# EAGLE design electrosteel2020_10_arrange6_newstringconnector (EAGLE 9.6.2)
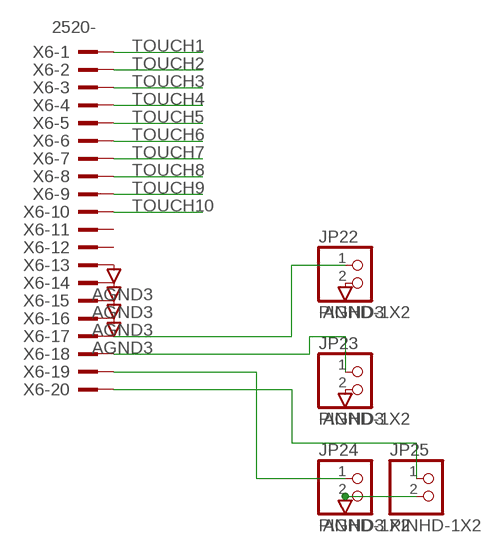
[diagram p0: schematic, sheet 1]

## Parts
JP22  PINHD-1X2  [1X02]
JP23  PINHD-1X2  [1X02]
JP24  PINHD-1X2  [1X02]
JP25  PINHD-1X2  [1X02]
X6  2520-  [PAK100/2500-20]

## Nets
AGND3: JP22.2 JP23.2 JP24.2 JP25.2 X6.13 X6.14 X6.15 X6.16
N$20: JP24.1 X6.19
N$22: JP25.1 X6.20
N$23: JP23.1 X6.18
N$24: JP22.1 X6.17
TOUCH1: X6.1
TOUCH2: X6.2
TOUCH3: X6.3
TOUCH4: X6.4
TOUCH5: X6.5
TOUCH6: X6.6
TOUCH7: X6.7
TOUCH8: X6.8
TOUCH9: X6.9
TOUCH10: X6.10
Unconnected: X6.11 X6.12

## Library data of the parts
JP22-JP25 = Connector:PINHD-1X2: PIN HEADER; CATEGORY: CONNECTOR; PARTNO: *DNP; SUB-CATEGORY: PIN-HEADER
X6 = con-3m:2520-: 3M (TM) Pak 100 4-Wall Header Source: 3M; OC_FARNELL: unknown; OC_NEWARK: unknown; PARTNO: N2520-6003-UG

## Board
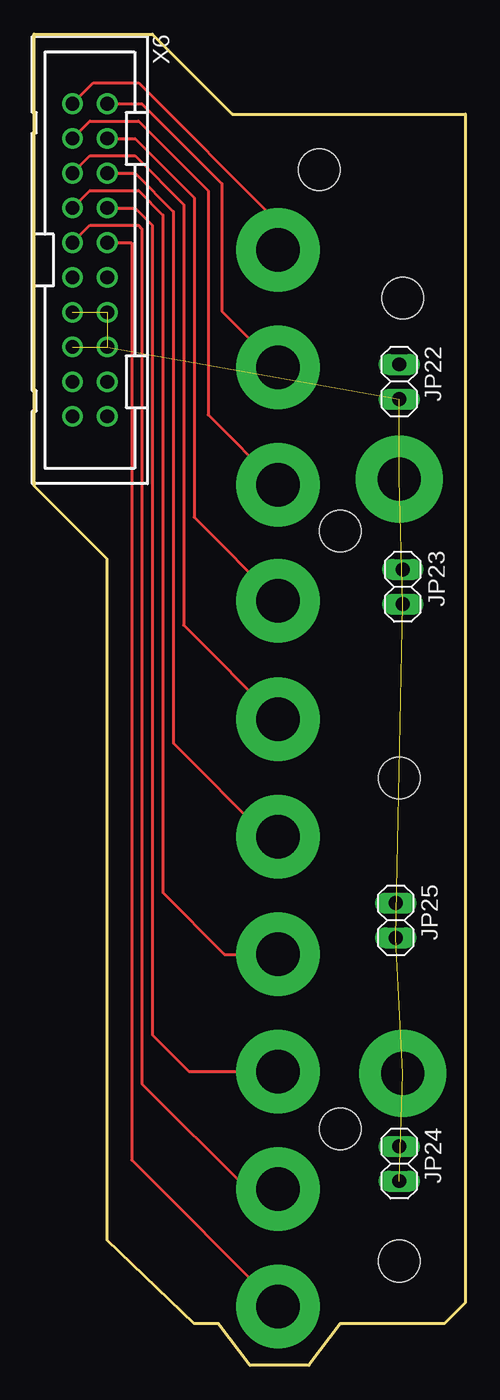
[diagram p1: board, top side]
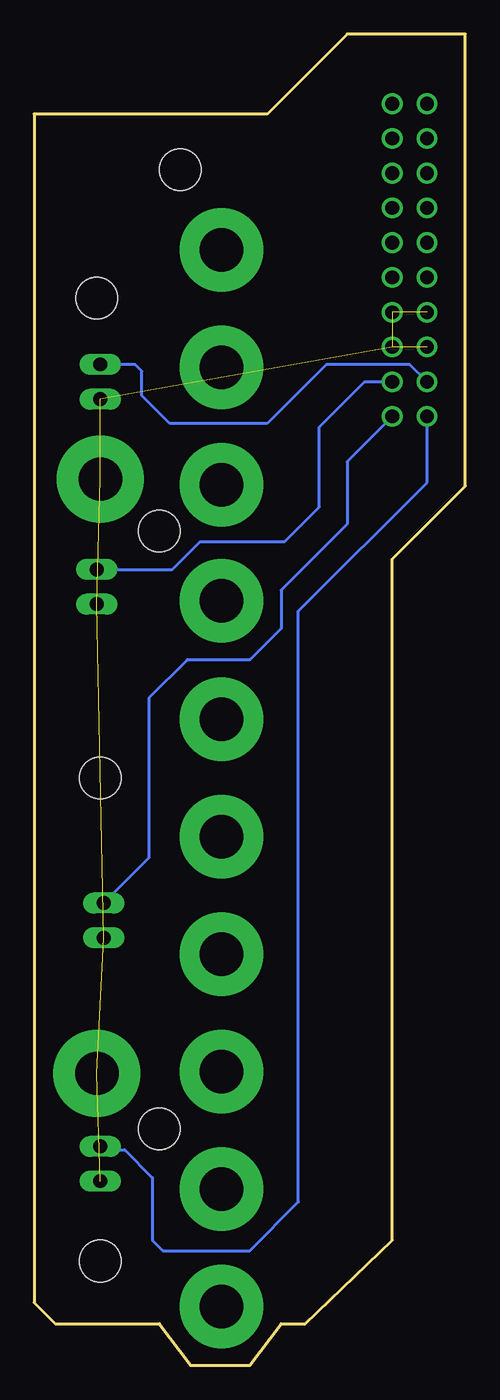
[diagram p2: board, bottom side, seen from below]

Size 31.5 x 97.28 mm. Coordinates in mm from the lower left corner, seen from the top.
Outline: 0,97.28 8.64,97.28 14.48,91.44 31.5,91.44 31.5,4.57 29.97,3.05 22.35,3.05 20.07,0 15.75,0 13.46,3.05 11.68,3.05 5.33,9.14 5.33,58.93 0,64.26 0,97.28
Copper layers (1+2*15+16): Top 0.035mm / dielectric 0.5mm / Route2 0.035mm / dielectric 0.5mm / Route15 0.035mm / dielectric 0.5mm / Bottom 0.035mm
Design rules "default *": minimum track width 6mil, minimum drill 0.35mm, track to track 9mil, track to pad 9mil, pad to pad 9mil, via to via 9mil, smd to smd 9mil, copper to edge 40mil, drill to drill 6mil, minimum pad ring 10mil, minimum via ring 8mil, stop-mask expansion 4mil, vias tented up to drill 0mil, thermal gap 10mil
Holes 3.05 mm at 26.92,77.98 26.67,7.62 26.67,42.93 20.83,87.38 22.35,60.96 22.35,17.27

### Footprints (pad centres in the part's own frame; a part is rotated, then mirrored left to right if it is on the bottom)
1X02 = drill 1.016 long: 1 -1.27,0; 2 1.27,0
PAK100/2500-20 = drill 1 pad 1.422: 1 -11.43,-1.27; 2 -11.43,1.27; 3 -8.89,-1.27; 4 -8.89,1.27; 5 -6.35,-1.27; 6 -6.35,1.27; 7 -3.81,-1.27; 8 -3.81,1.27; 9 -1.27,-1.27; 10 -1.27,1.27; 11 1.27,-1.27; 12 1.27,1.27; 13 3.81,-1.27; 14 3.81,1.27; 15 6.35,-1.27; 16 6.35,1.27; 17 8.89,-1.27; 18 8.89,1.27; 19 11.43,-1.27; 20 11.43,1.27

### Placement (x,y rotation side)
JP22  26.67,71.88 270 top
JP23  26.92,56.9 270 top
JP24  26.67,14.73 270 top
JP25  26.42,32.51 270 top
X6  4.06,80.77 270 top

### Tracks (layer width: path | path; a pad name or v marks a point on that pad's centre or on a via)
AGND3  (via drill 3.17 pad 6.35)  (9 unrouted)
  other vias: 26.67,64.77 26.92,21.34
N$20
  Bottom 0.203: JP24.1 26.42,15.75 24.89,15.75 22.86,13.72 22.86,9.14 22.1,8.38 15.75,8.38 12.19,11.94 12.19,55.12 2.79,64.52 X6.19
N$22
  Bottom 0.203: X6.20 8.64,66.04 8.64,61.47 13.46,56.64 13.46,53.85 15.75,51.56 20.32,51.56 23.11,48.77 23.11,37.08 JP25.1
N$23
  Bottom 0.203: JP23.1 21.41,58.17 19.38,60.2 13.21,60.2 10.67,62.74 10.67,68.58 7.37,71.88 X6.18
N$24
  Bottom 0.203: X6.17 4.06,73.15 10.16,73.15 14.48,68.83 21.59,68.83 23.62,70.87 23.62,72.64 24.13,73.15 JP22.1
TOUCH1  (via drill 3.17 pad 6.1)
  Top 0.203: X6.1 4.32,93.73 7.62,93.73 17.81,83.54 v17.81,81.52
TOUCH2  (via drill 3.17 pad 6.1)
  Top 0.203: X6.2 7.87,92.2 13.72,86.36 13.72,77.03 v17.81,72.94
TOUCH3  (via drill 3.17 pad 6.1)
  Top 0.203: X6.3 4.06,90.93 7.62,90.93 12.7,85.85 12.7,69.47 v17.81,64.36
TOUCH4  (via drill 3.17 pad 6.1)
  Top 0.203: X6.4 7.37,89.66 11.68,85.34 11.68,61.98 v17.81,55.86
TOUCH5  (via drill 3.17 pad 6.1)
  Top 0.203: X6.5 4.06,88.39 7.37,88.39 10.92,84.84 10.92,54.09 v17.81,47.21
TOUCH6  (via drill 3.17 pad 6.1)
  Top 0.203: X6.6 7.37,87.12 10.16,84.33 10.16,45.47 17,38.63 v17.81,38.63
TOUCH7  (via drill 3.17 pad 6.1)
  Top 0.203: X6.7 4.06,85.85 7.62,85.85 9.4,84.07 9.4,34.54 13.9,30.05 v17.81,30.05
TOUCH8  (via drill 3.17 pad 6.1)
  Top 0.203: X6.8 7.37,84.58 8.64,83.31 8.64,24.13 11.3,21.47 v17.81,21.47
TOUCH9  (via drill 3.17 pad 6.1)
  Top 0.203: X6.9 4.06,83.31 7.62,83.31 7.87,83.06 7.87,20.57 15.56,12.89 v17.81,12.89
TOUCH10  (via drill 3.17 pad 6.1)
  Top 0.203: X6.10 7.11,82.04 7.11,15.01 v17.81,4.31